# EasyEDA schematic EasyEDA_ATTinyX5_ICSP_V1_Schematic.json
TITLE: ATTinyX5 ICSP Programmer; REV: 1.0; Date: 2020-09-01; Sheet: 1/1; Drawn By: Devin Watson; Company: Braining
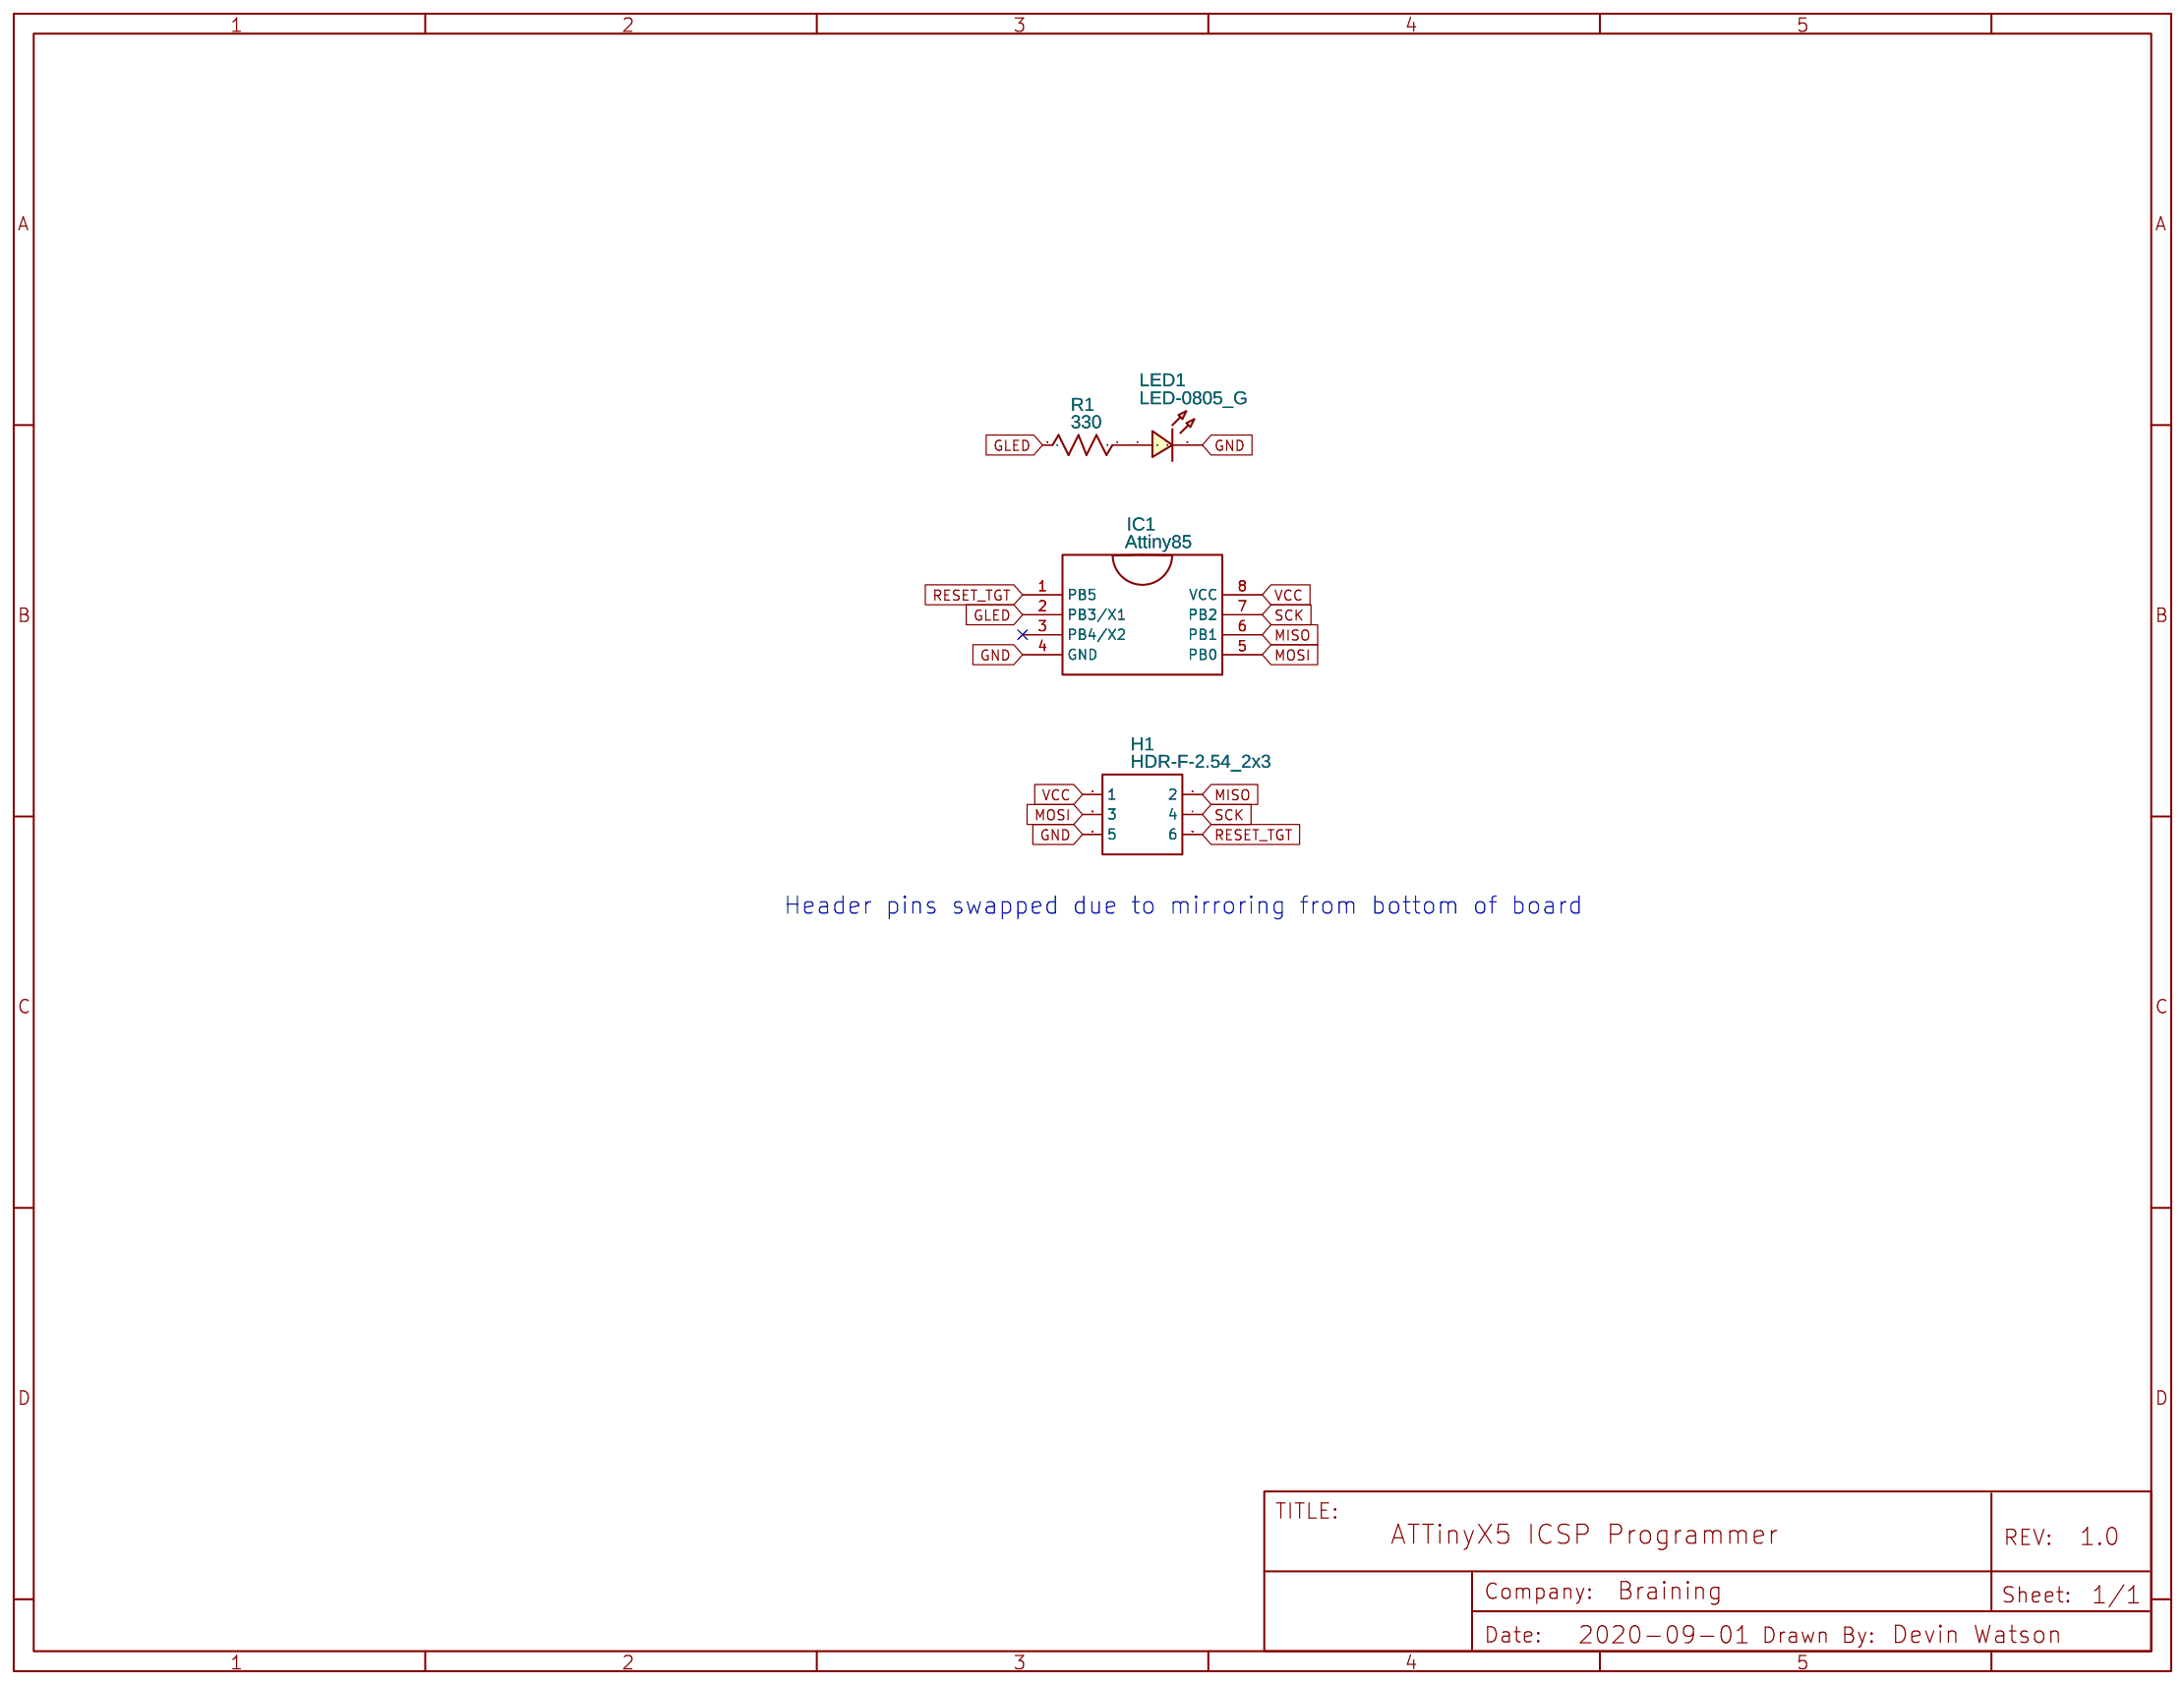
[diagram p0: schematic sheet]

## Parts
H1  HDR-F-2.54_2x3  [HDR-F-2.54_2X3]
IC1  Attiny85  [DIP8]
LED1  LED-0805_G  [LED0805_GREEN]
R1  330  [R0805]

## Library data of the parts
H1 = HDR-F-2.54_2x3: Supplier Part: C65114; Supplier: LCSC; Contributor: LCEDA_Lib
IC1 = Attiny85: Contributor: Nuros
LED1 = LED-0805_G: Manufacturer: Everlight; Manufacturer Part: 17-21SYGC/S530-E2/TR8; Supplier Part: 638-1721SYGCS530E2; Supplier: Mouser; Contributor: LCEDA_Lib
R1 = R_0805_US: Supplier Part: 71-CRCW0805330RJNEAC; Supplier: Mouser; Contributor: LCEDA_Lib; Manufacturer Part: CRCW0805330RJNEAC; Manufacturer: Vishay/Dale

## Nets
GND: H1.5 IC1.4(GND) LED1.2
VCC: H1.1 IC1.8(VCC)
GLED: IC1.2(PB3/X1) R1.1
MISO: H1.2 IC1.6(PB1)
MOSI: H1.3 IC1.5(PB0)
RESET_TGT: H1.6 IC1.1(PB5)
SCK: H1.4 IC1.7(PB2)
Net-(LED1-1): LED1.1 R1.2

Not connected (* = marked no-connect by the designer): IC1 3(PB4/X2)*

## Notes on the sheet
- Header pins swapped due to mirroring from bottom of board
